# EAGLE design connect_ecg_cable (EAGLE 7.3.0)
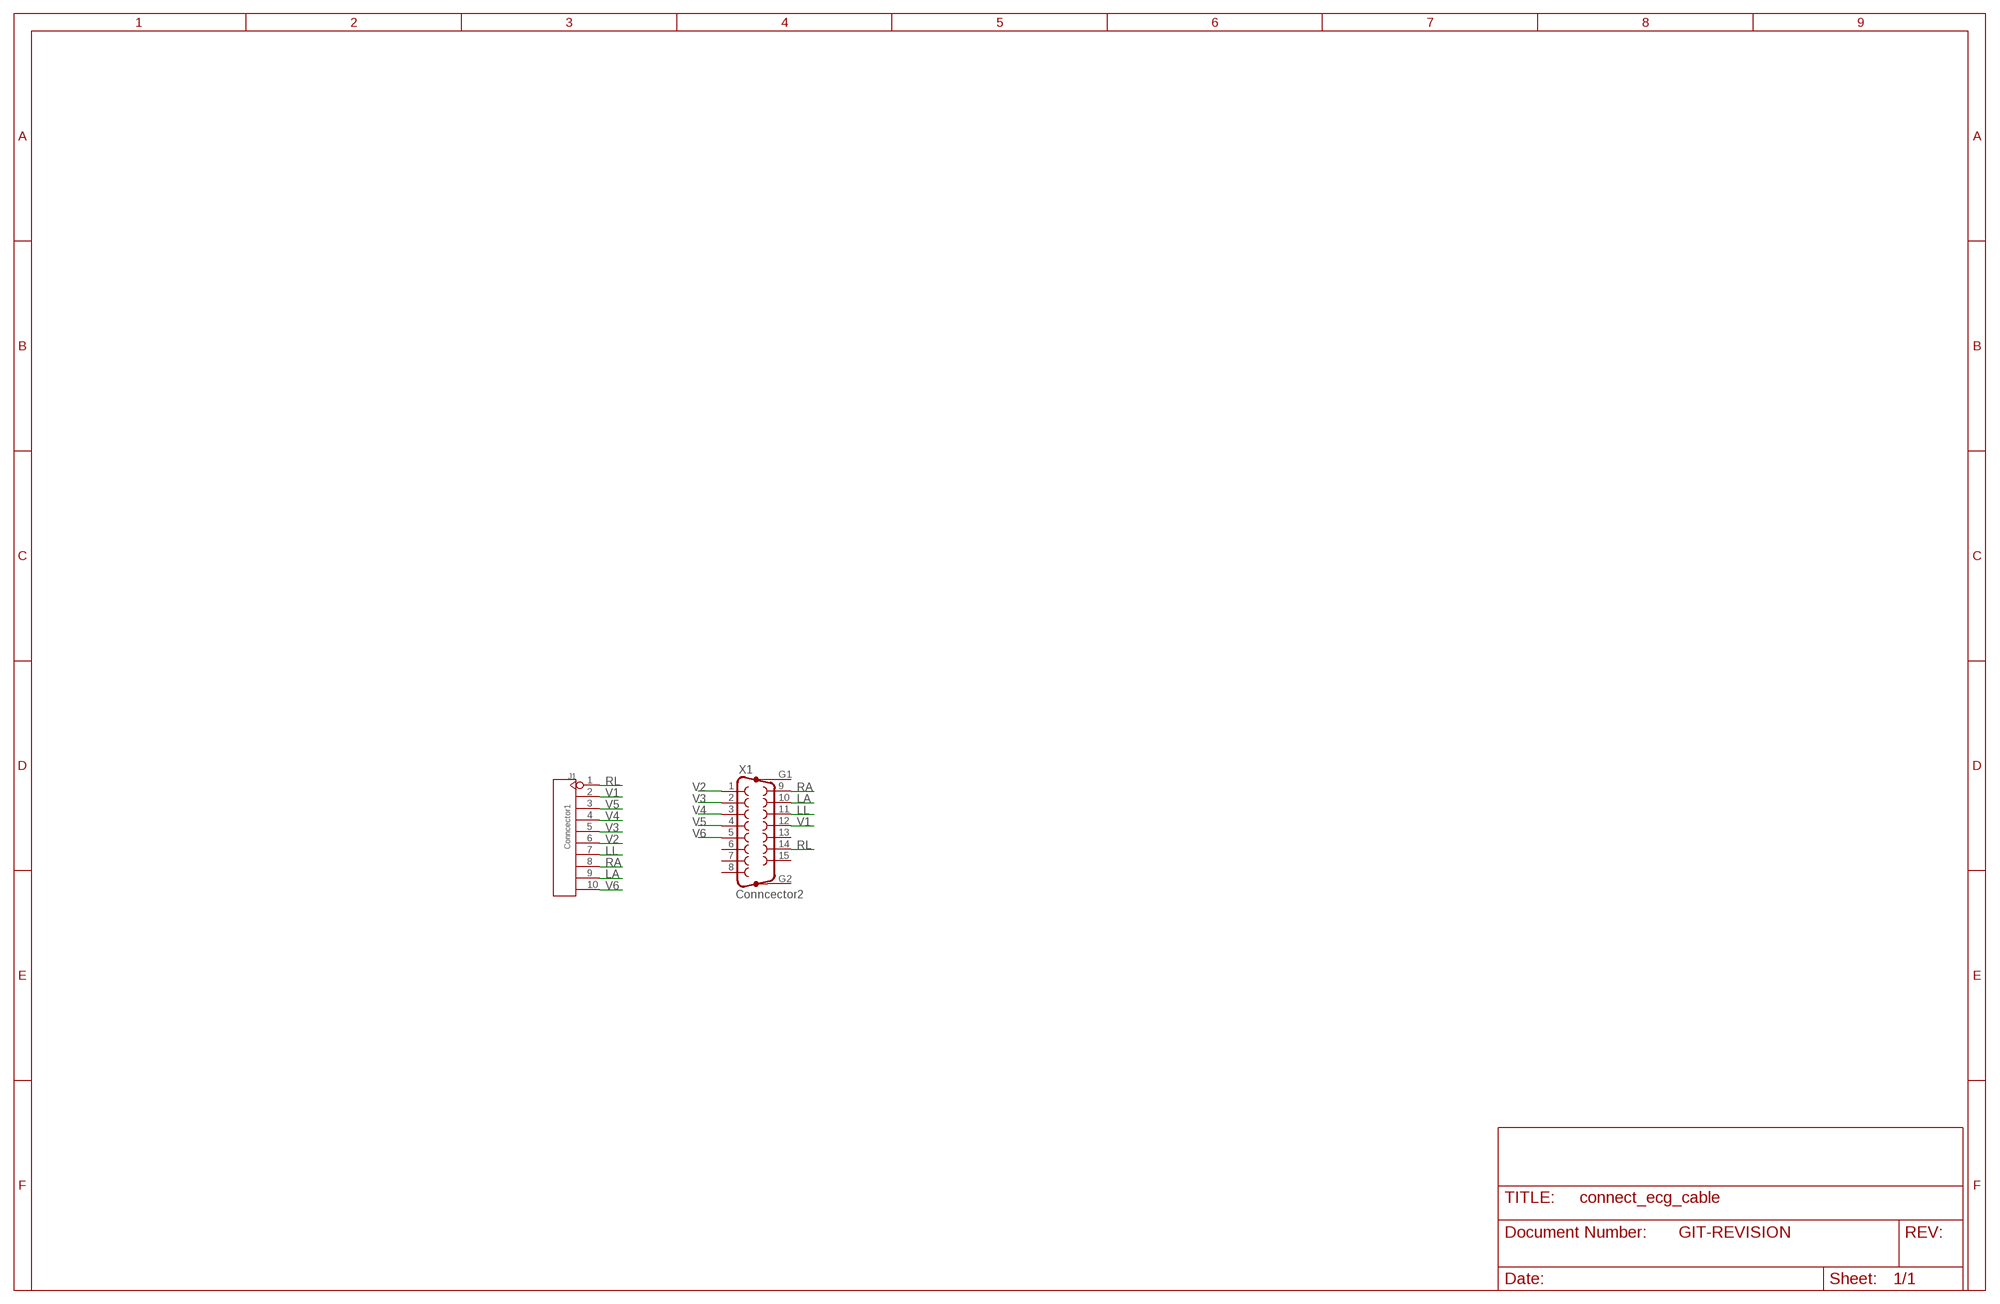
[diagram p0: schematic, sheet 1]

## Parts
J1  Conncector1  CONNECTOR-HEADER-10P-320030001  [1X10P-2.54-8.5--BLUE-FEMALE]
U$1  GIT-REVISION  [GIT-REVISION]
X1  Conncector2  F15HP  [F15HP]

## Nets
LA: J1.9 X1.10
LL: J1.7 X1.11
RA: J1.8 X1.9
RL: J1.1 X1.14
V1: J1.2 X1.12
V2: J1.6 X1.1
V3: J1.5 X1.2
V4: J1.4 X1.3
V5: J1.3 X1.4
V6: J1.10 X1.5
Unconnected: X1.6 X1.7 X1.8 X1.13 X1.15 X1.G1 X1.G2

## Library data of the parts
J1 = MyECG_OPL:CONNECTOR-HEADER-10P
U$1 = git-revision:GIT-REVISION
X1 = con-subd:F15HP: SUB-D; OC_FARNELL: unknown; OC_NEWARK: unknown

## Board
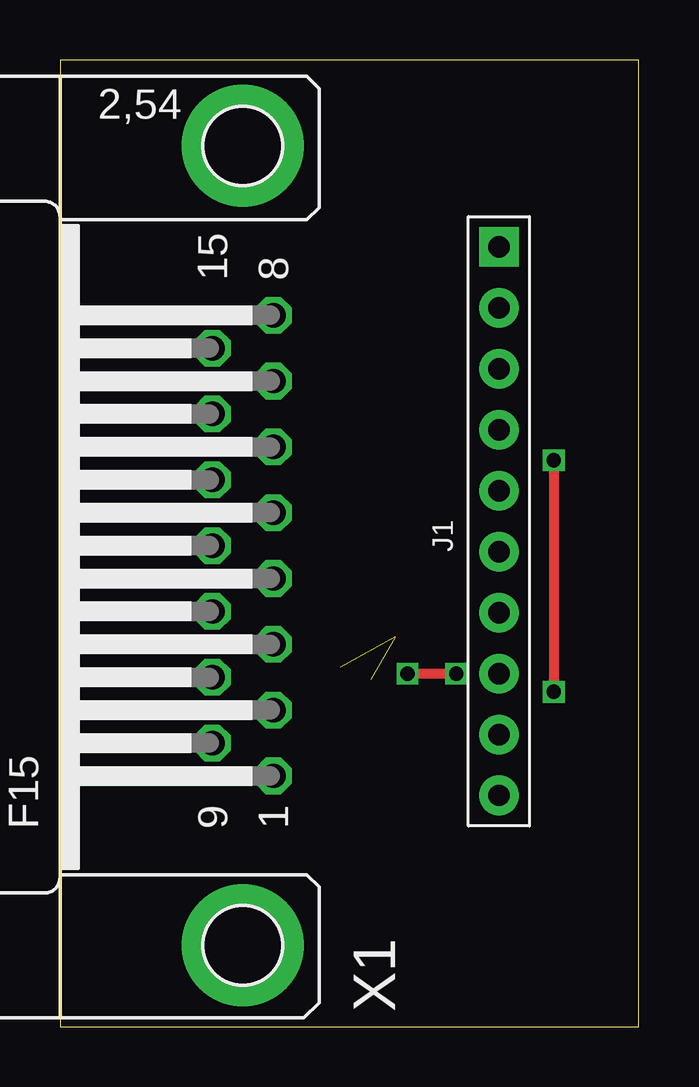
[diagram p1: board, top side]
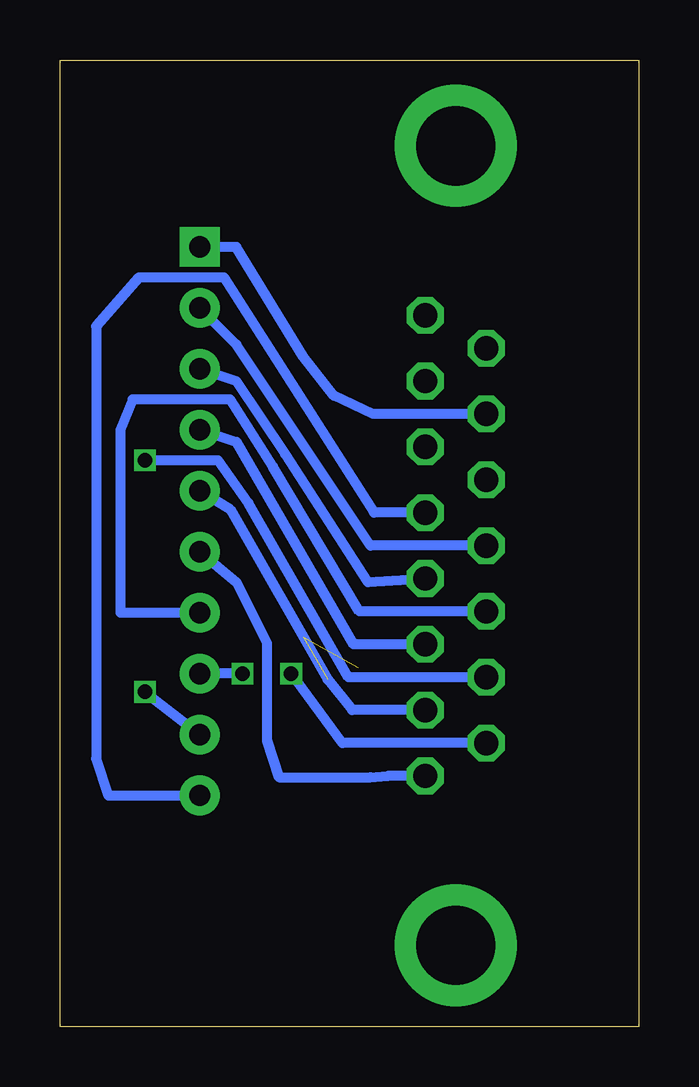
[diagram p2: board, bottom side, seen from below]

Size 24.11 x 40.31 mm. Coordinates in mm from the lower left corner, seen from the top.
Outline: 0,0 24.11,0 24.11,40.31 0,40.31 0,0
Copper layers (1*16): Top 0.035mm / dielectric 1.6mm / Bottom 0.035mm
Design rules "Elecrow_2-layer_PCB_eagle_rule": minimum track width 6mil, minimum drill 12mil, track to track 6mil, track to pad 6mil, pad to pad 6mil, via to via 8mil, smd to smd 0mil, copper to edge 20mil, drill to drill 10mil, minimum pad ring 6mil, minimum via ring 6mil, stop-mask expansion 0mil, vias tented up to drill 100mil, thermal gap 10mil

### Footprints (pad centres in the part's own frame; a part is rotated, then mirrored left to right if it is on the bottom)
1X10P-2.54-8.5--BLUE-FEMALE = drill 0.889 pad 1.651 square: 1 0,11.43 | drill 0.889 pad 1.651: 2 0,8.89; 3 0,6.35; 4 0,3.81; 5 0,1.27; 6 0,-1.27; 7 0,-3.81; 8 0,-6.35; 9 0,-8.89; 10 0,-11.43
F15HP = drill 1.016 octagon: 1 -9.601,-1.27; 2 -6.858,-1.27; 3 -4.115,-1.27; 4 -1.372,-1.27; 5 1.372,-1.27; 6 4.115,-1.27; 7 6.858,-1.27; 8 9.601,-1.27; 9 -8.23,1.27; 10 -5.486,1.27; 11 -2.743,1.27; 12 0,1.27; 13 2.743,1.27; 14 5.486,1.27; 15 8.23,1.27 | drill 3.302 pad 5.08: G1 -16.662,0; G2 16.662,0

### Placement (x,y rotation side)
J1  18.29,21.08 0 top
U$1  19.3,1.02 0 top
X1  7.62,20.07 90 top

### Tracks (layer width: path | path; a pad name or v marks a point on that pad's centre or on a via)
LA  (via drill 0.6)
  Top 0.406: v20.57,23.62 v20.57,13.97
  Bottom 0.406: X1.10 12.09,14.58 16.26,21.84 17.53,23.62 v20.57,23.62 | v20.57,13.97 J1.9
LL
  Bottom 0.406: X1.11 11.63,17.32 15.24,23.37 17.02,26.16 21.08,26.16 21.59,24.89 21.59,17.27 J1.7
RA  (via drill 0.6)
  Top 0.406: v14.48,14.73 v16.51,14.73
  Bottom 0.406: X1.9 12.34,11.84 v14.48,14.73 | v16.51,14.73 J1.8
RL
  Bottom 0.406: X1.14 11.07,25.55 12.7,26.31 13.97,27.94 16.76,32.51 J1.1
V1
  Bottom 0.406: X1.12 11.18,20.07 16.76,28.45 J1.2
V2
  Bottom 0.406: J1.6 16.76,18.54 15.49,16 15.49,11.94 14.99,10.41 11.18,10.41 10.46,10.46 X1.1
V3  (2 unrouted)
  Bottom 0.406: J1.5 17.02,21.59 12.95,14.48 11.94,13.21 X1.2
V4
  Bottom 0.406: J1.4 16.76,24.38 11.89,15.95 X1.3
V5
  Bottom 0.406: J1.3 16.76,26.92 14.73,23.88 11.28,18.54 X1.4
V6
  Bottom 0.406: X1.5 11.02,21.44 17.27,31.24 20.83,31.24 22.61,29.21 22.61,11.18 22.1,9.65 J1.10